# Altium schematic sheet Source.SchDoc
size A3
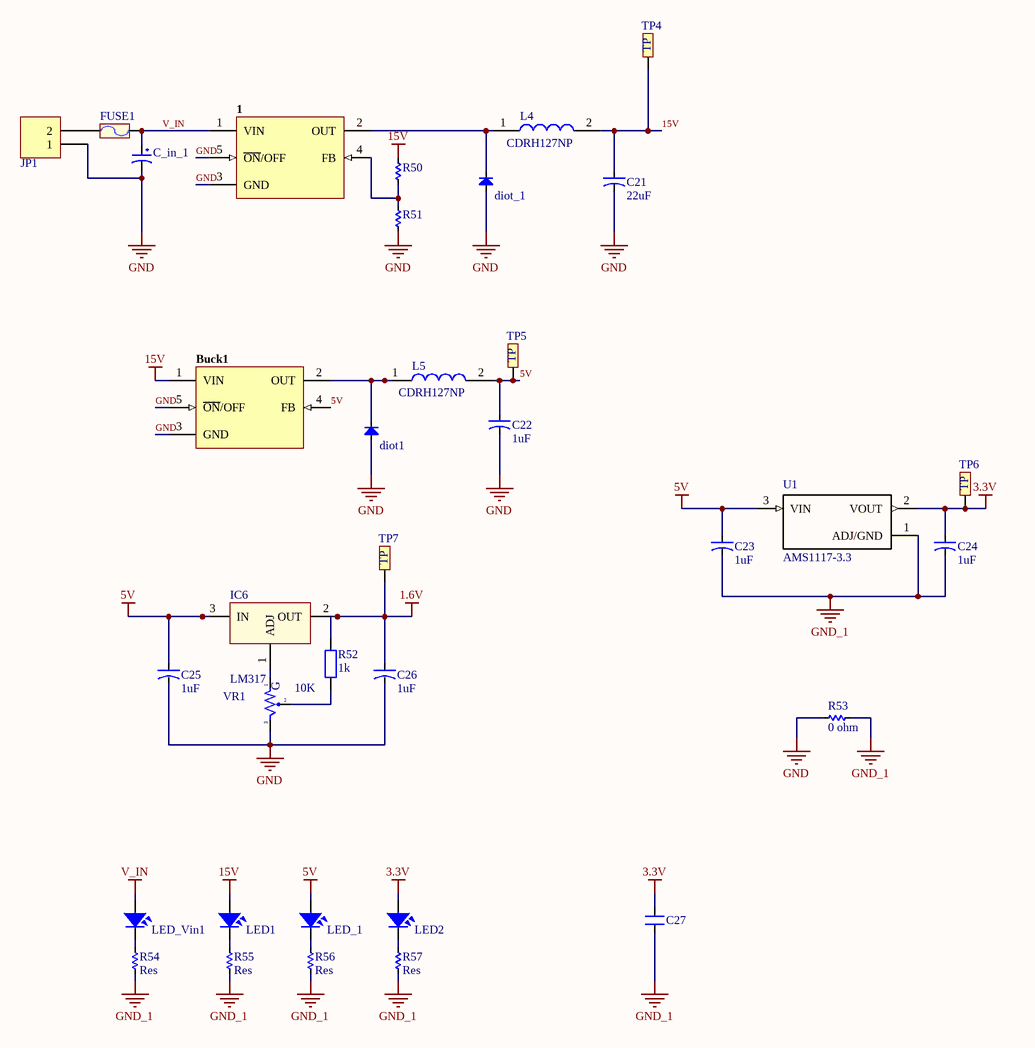
[diagram p0: Source.SchDoc]

## Parts
1  LM2576  [TO263]  (value not drawn)
Buck1  LM2576  [TO263]  (value not drawn)
C21  22uF  [CA-ALU-2.54]
C22  1uF  [CA-ALU-2.54]
C23  1uF  [CA-ALU-2.54]
C24  1uF  [CA-ALU-2.54]
C25  1uF  [CA-ALU-2.54]
C26  1uF  [CA-ALU-2.54]
C27  104,0805  [CN-SMD-0805]  (value not drawn)
C_in_1  100uF  [CP1.5/3.4]  (value not drawn)
diot1  Diode SMD  [DIO-SMD-106]  (value not drawn)
diot_1  Diode SMD  [DIO-SMD-106]  (value not drawn)
FUSE1  F1A  [Fuse1]  (value not drawn)
IC6  LM317  [TO220NH]
JP1  Header 2_1  [HED2]  (value not drawn)
L4  CDRH127NP  [INDPM120120X800N]
L5  CDRH127NP  [INDPM120120X800N]
LED1  power 0805  [LED-0805-Blue]  (value not drawn)
LED2  power 0805  [LED-0805-Blue]  (value not drawn)
LED_1  power 0805  [LED-0805-Blue]  (value not drawn)
LED_Vin1  power 0805  [LED-0805-Blue]  (value not drawn)
R50  Res  [RES-SMD-0805]  (value not drawn)
R51  Res  [RES-SMD-0805]  (value not drawn)
R52  1k  [R1/4W]
R53  0 ohm  [RES-SMD-1206]
R54  Res  [RES-1/2W]
R55  Res  [RES-1/2W]
R56  Res  [RES-1/2W]
R57  Res  [RES-1/2W]
TP4  (no value)  [TP]
TP5  (no value)  [TP]
TP6  (no value)  [TP]
TP7  (no value)  [TP]
U1  AMS1117-3.3  [*SOT229P700X180-4N]
VR1  10K  [VR-S2]

## Nets
1.6V: C26.1 IC6.2(OUT) R52.2 TP7.TP1
3.3V: C24.1 C27.2 LED2.1 TP6.TP1 U1.2(VOUT)
5V: Buck1.4(FB) C22.1 C23.1 C25.1 IC6.3(IN) L5.2 LED_1.1 TP5.TP1 U1.3(VIN)
15V: Buck1.1(VIN) C21.1 L4.2 LED1.1 R50.1 TP4.TP1
GND: 1.3(GND) 1.5(~{ON}/OFF) Buck1.3(GND) Buck1.5(~{ON}/OFF) C21.2 C22.2 C25.2 C26.2 C_in_1.2 diot1.1(A) diot_1.1(A) JP1.1 R51.2 R53.1 VR1.3
GND_1: C23.2 C24.2 C27.1 R53.2 R54.2 R55.2 R56.2 R57.2 U1.1(ADJ/GND)
V_IN: 1.1(VIN) C_in_1.1 FUSE1.2 LED_Vin1.1
Net1_2: 1.2(OUT) diot_1.2(K) L4.1
Net1_4: 1.4(FB) R50.2 R51.1
NetBuck1_2: Buck1.2(OUT) diot1.2(K) L5.1
NetFUSE1_1: FUSE1.1 JP1.2
NetIC6_1: IC6.1(ADJ) VR1.1
NetLED1_2: LED1.2 R55.1
NetLED2_2: LED2.2 R57.1
NetLED_1_2: LED_1.2 R56.1
NetLED_Vin1_2: LED_Vin1.2 R54.1
NetR52_1: R52.1 VR1.2

## Notes on the sheet
- (in symbol VR-S) G

## Library data of the parts
1 Buck1 = LM2576: Max Input Voltage: 12 V; Max Output Current: 3 (6.0 peak) A; Max Output Voltage: mV; Category: IC-Power; Min Input Voltage: mV; Min Output Voltage: mV; Mounting Technology: Surface Mount; Status: Unreleased; Supply Voltage: mV; Temperature Range: -40 to +125 degC
C21-C26 = CN-ALU-DIP: Capacitor (Semiconductor SIM Model); Value: 104; LatestRevisionDate: 17-Jul-2002; LatestRevisionNote: Re-released for DXP Platform.; PackageReference: C1206; Publisher: Altium Limited
C27 = CN: Value: 33pF
C_in_1 = CP4: Cap 1000uF/16V - 220uF/50V; Description 5: 4,7uF>10uF/250V_3,3uF>10uF/400V - 2,2uF>4,7uF/450V; Description 1: 2200uF-3300uF/6,3V - 1000uF-2200uF/10V; Description 2: 1000uF/16V - 470uF => 1000uF/25V - 100uF/100V; Description 3: 330uF>470uF/35V_220uF>470uF/50V_10uF>22uF/250V; Description 4: 220uF => 330uF/63V - 10uF =>33uF/160 - 200V; Value: 1000uF/16V
diot1 diot_1 = Diode SMD: Default Diode; Code - JEDEC: DO-214-AB; Value: 1N5007; Published: 8-Jun-2000; Revision: July-2002: Re-released for DXP Platform.; Publisher: Altium Limited
FUSE1 = Fuse: Designed by: VanDungEvn; Value: Fuse
IC6 = LM317: Adj Voltage +1.2 -> +37V; Value: LM317
JP1 = Header 2_1: Header, 2-Pin; Manufacturer: Generic Components; Class: Connector; Value: Header 2
L4 L5 = CDRH127NP-330MC: Inductor; Manufacturer_Name: Sumida; Datasheet Link: http://products.sumida.com/products/pdf/CDRH127.pdf; Height: 8mm; Manufacturer_Part_Number: CDRH127NP-330MC; Mouser Part Number: 851-CDRH127NP-330MC; Mouser Price/Stock: https://www.mouser.co.uk/ProductDetail/Sumida/CDRH127NP-330MC?qs=YW7jAfUHneFV96nY7FREjQ%3D%3D
LED1 LED2 LED_1 LED_Vin1 = LED SMD: Value: LED 3 - 5 ly 2 Colour
R50 R51 R53 = Res-SMD: Resistor; Manufacturer: Generic Components; Class: Passive; Published: 08/06/2000; Publisher: Altium Hobart Technology Centre
R52 = R1/4W: Resistor 1/4W; Value: R1/4W - 1K
R54-R57 = Res: Manufacturer: Generic Components; Class: Passive; SubClass: R; Published: 08/06/2000; Publisher: Altium Hobart Technology Centre
TP4-TP7 = TP: CONNECT 1
U1 = AMS1117-3.3: Sot223/Pkg 1-Amp 3.3-Volt Low Drop Out Voltage Regulatator; MF: Advanced Monolithic Systems; Availability: Unavailable; SnapEDA_Link: https://www.snapeda.com/parts/AMS1117-3.3/Advanced%20Monolithic%20Systems/view-part/53450/?ref=snap; Price: None; Package: None; MP: AMS1117-3.3; Value: *
VR1 = VR-S: Var Resistor; Value: Volume 50k